# EAGLE design headlight (EAGLE 5.09)
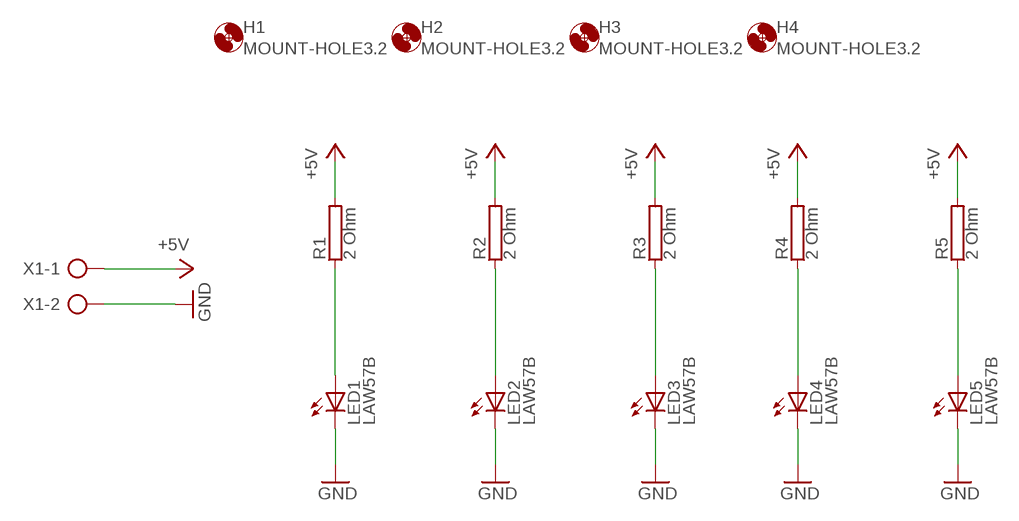
[diagram p0: schematic, sheet 1]

## Parts
H1  MOUNT-HOLE3.2  [3,2]
H2  MOUNT-HOLE3.2  [3,2]
H3  MOUNT-HOLE3.2  [3,2]
H4  MOUNT-HOLE3.2  [3,2]
LED1  LAW57B  [W57B]
LED2  LAW57B  [W57B]
LED3  LAW57B  [W57B]
LED4  LAW57B  [W57B]
LED5  LAW57B  [W57B]
R1  2 Ohm  RKH216-8  [KH216-8]
R2  2 Ohm  RKH216-8  [KH216-8]
R3  2 Ohm  RKH216-8  [KH216-8]
R4  2 Ohm  RKH216-8  [KH216-8]
R5  2 Ohm  RKH216-8  [KH216-8]
X1  AK300/2  [AK300/2]

## Nets
+5V: R1.2 R2.2 R3.2 R4.2 R5.2 X1.1
GND: LED1.C LED2.C LED3.C LED4.C LED5.C X1.2
N$1: LED1.A R1.1
N$2: LED2.A R2.1
N$3: LED3.A R3.1
N$4: LED4.A R4.1
N$5: LED5.A R5.1
Unconnected: LED1.C@1(C) LED1.C@2(C) LED1.C@3(C) LED1.C@4(C) LED1.C@5(C) LED2.C@1(C) LED2.C@2(C) LED2.C@3(C) LED2.C@4(C) LED2.C@5(C) LED3.C@1(C) LED3.C@2(C) LED3.C@3(C) LED3.C@4(C) LED3.C@5(C) LED4.C@1(C) LED4.C@2(C) LED4.C@3(C) LED4.C@4(C) LED4.C@5(C) LED5.C@1(C) LED5.C@2(C) LED5.C@3(C) LED5.C@4(C) LED5.C@5(C)

## Library data of the parts
H1-H4 = holes:MOUNT-HOLE: MOUNTING HOLE with drill center marker
LED1-LED5 = led:*W57B: Golden Dragon® 1 Watt LED Place heat sink pads of cathode with INVOKE Source: www.osram-os.com la_ly_w57b.pdf
R1-R5 = resistor-power:R: Power Resitor
X1 = con-ptr500:AK300/2: CONNECTOR

## Board
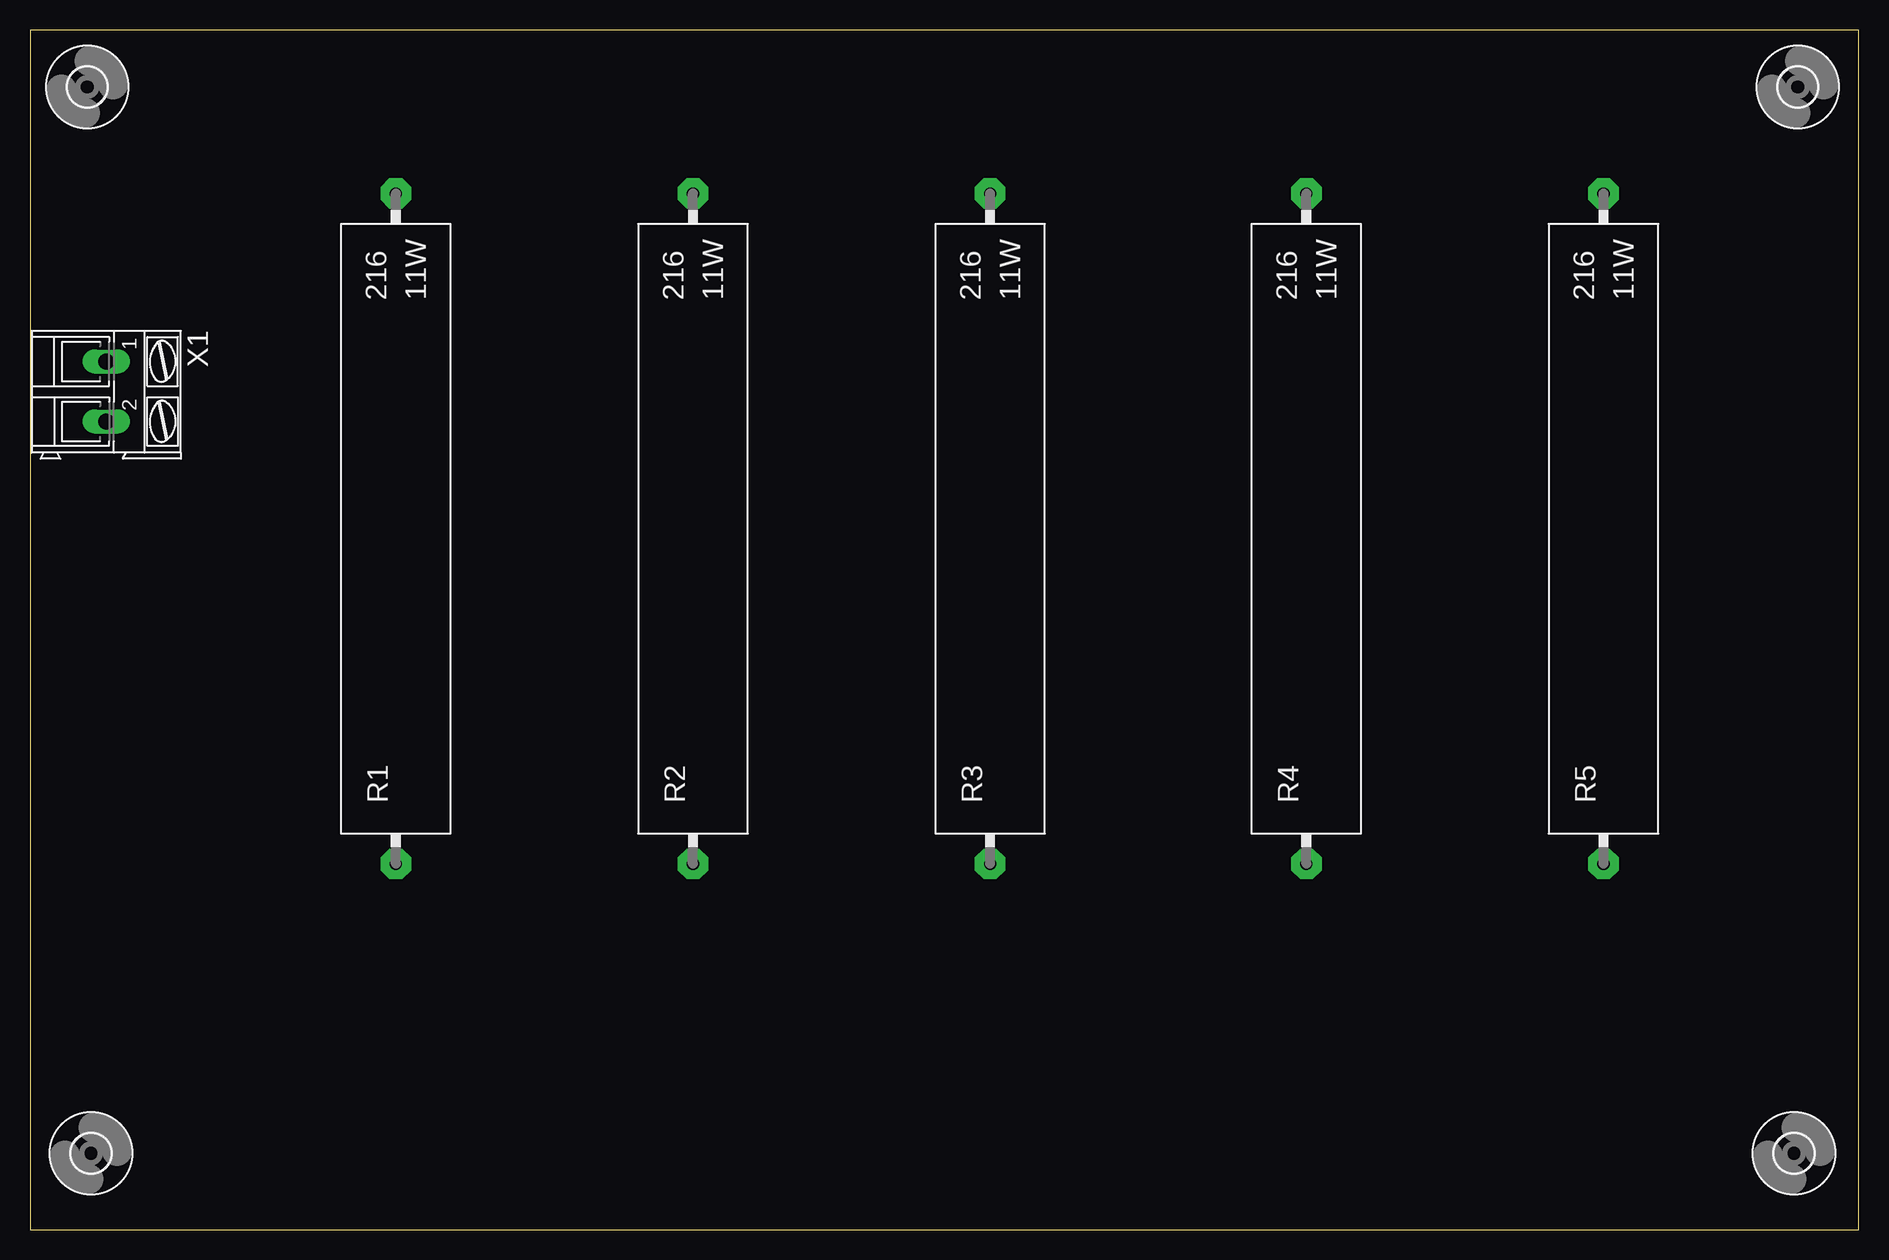
[diagram p1: board, top side]
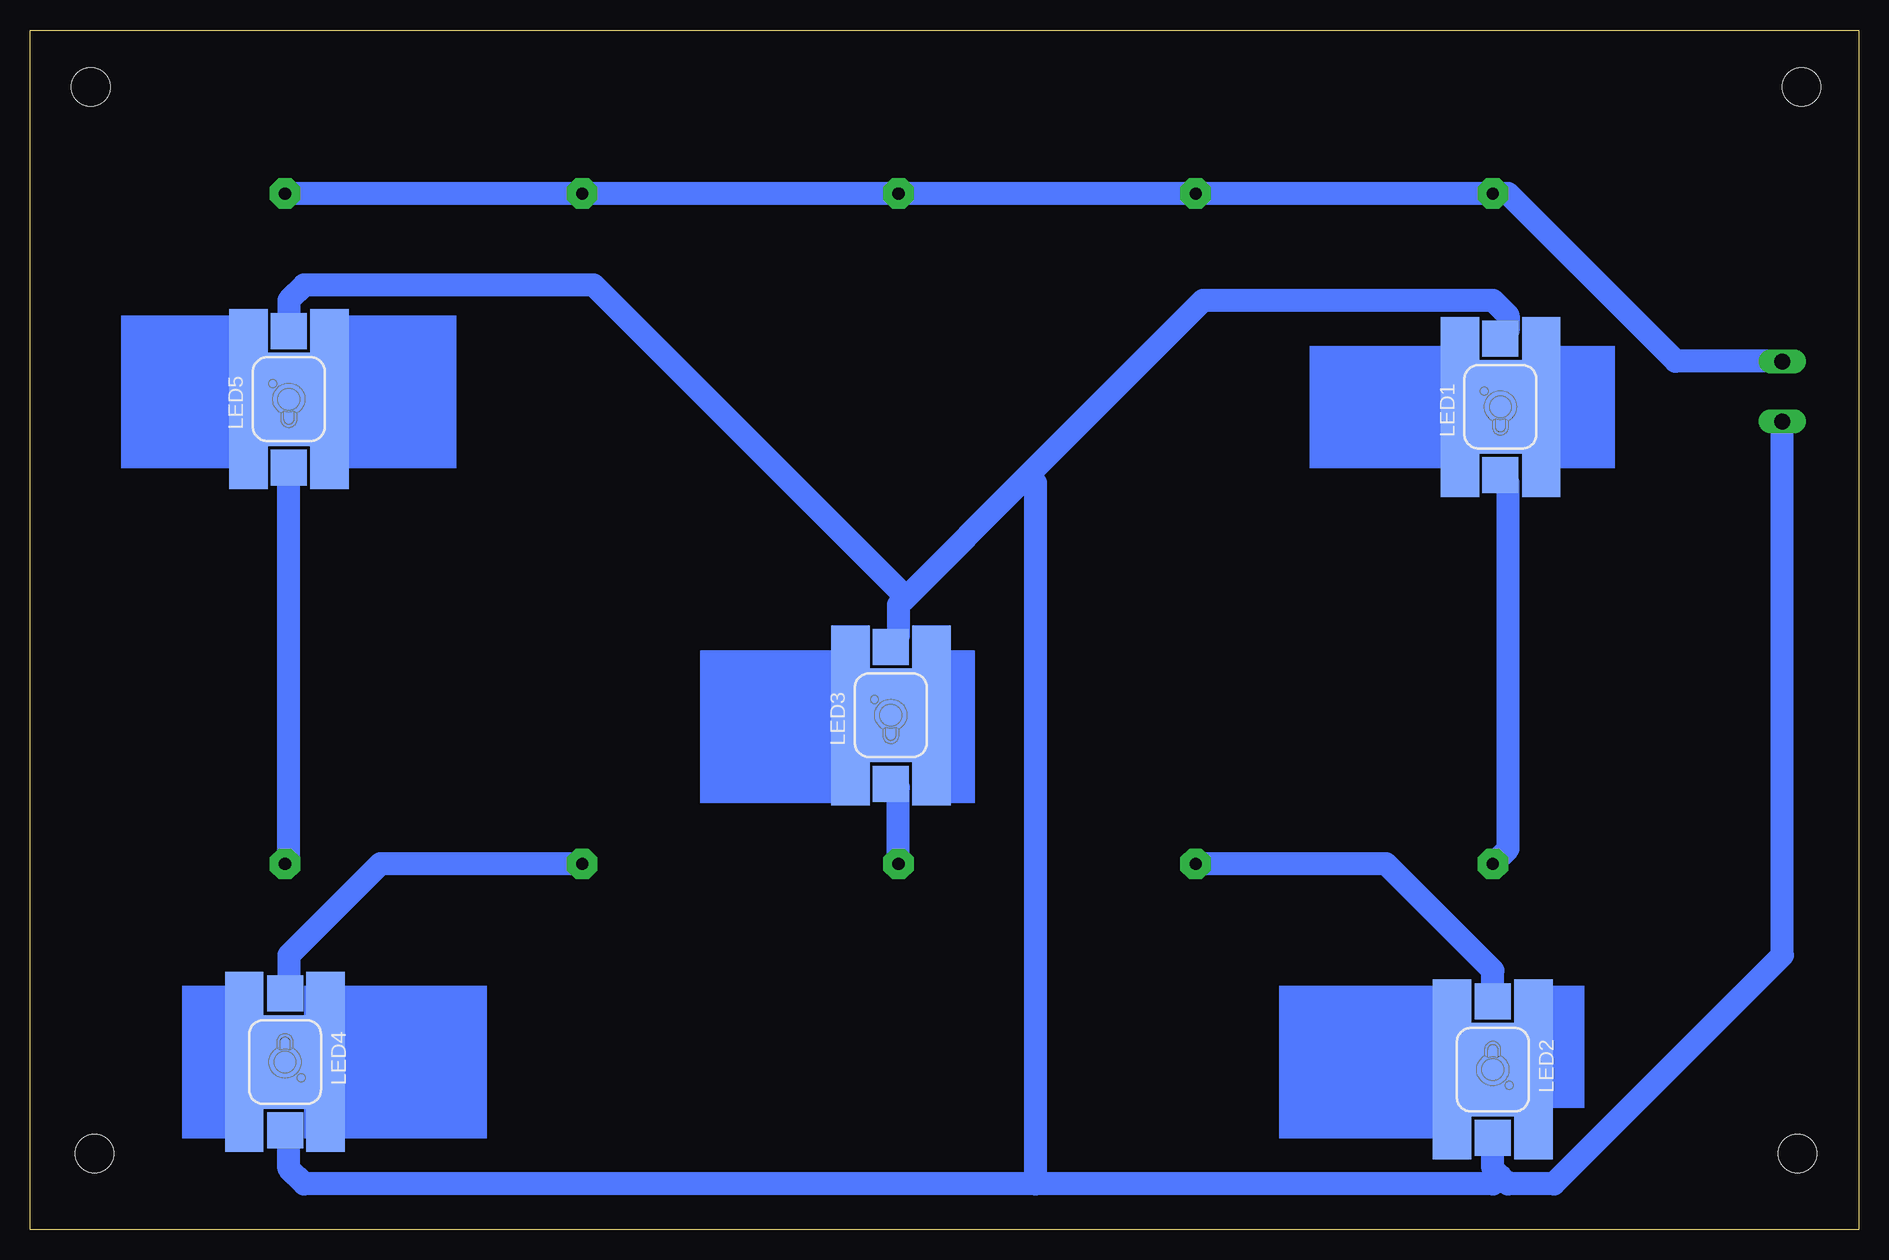
[diagram p2: board, bottom side, seen from below]

Size 152.38 x 100 mm. Coordinates in mm from the lower left corner, seen from the top.
Outline: 0,0 152.38,0 152.38,100 0,100 0,0
Copper layers (1*16): Top 0.035mm / dielectric 1.5mm / Bottom 0.035mm
Design rules "default *": minimum track width 75mil, minimum drill 24mil, track to track 8mil, track to pad 8mil, pad to pad 8mil, via to via 8mil, smd to smd 8mil, copper to edge 40mil, drill to drill 8mil, minimum pad ring 10mil, minimum via ring 8mil, stop-mask expansion 4mil, vias tented up to drill 0mil, thermal gap 10mil

### Footprints (pad centres in the part's own frame; a part is rotated, then mirrored left to right if it is on the bottom)
3,2 = hole 3.2: 0,0
W57B = smd 3 x 3: A -5.7,0; C 5.7,0 | smd 7.5 x 3.2: C@1 3.75,3.375; C@2 -3.75,3.375; C@3 -3.75,-3.4; C@4 3.75,-3.4 | smd 7.8 x 4: C@5 0,0
KH216-8 = drill 1.016 pad 2.54 octagon: 1 -27.94,0; 2 27.94,0
AK300/2 = drill 1.321 long: 1 -2.515,0; 2 2.489,0

### Placement (x,y rotation side)
H1  147.32,95.25 0 top
H2  5.08,6.35 0 top
H3  147,6.35 0 top
H4  4.76,95.25 0 top
LED1  29.84,68.58 90 bottom
LED2  30.48,13.34 270 bottom
LED3  80.64,42.86 90 bottom
LED4  131.13,13.97 270 bottom
LED5  130.81,69.22 90 bottom
R1  30.48,58.42 90 top
R2  55.24,58.42 90 top
R3  80.01,58.42 90 top
R4  106.36,58.42 90 top
R5  131.13,58.42 90 top
X1  6.35,69.85 270 top

### Tracks (layer width: path | path; a pad name or v marks a point on that pad's centre or on a via)
+5V
  Bottom 1.905: R5.2 R4.2 R3.2 R2.2 R1.2 29.21,86.36 15.24,72.39 6.35,72.39 X1.1
GND
  Bottom 1.905: 69.22,62.87 54.61,77.47 30.48,77.47 29.21,76.2 29.21,74.93 LED1.C | 69.22,62.87 79.38,52.7 | 79.38,52.7 80.01,52.07 80.01,49.53 LED3.C | LED5.C 130.81,77.47 129.54,78.74 105.41,78.74 79.38,52.7 | 29.84,4.45 29.21,3.81 25.4,3.81 6.35,22.86 X1.2 | 29.84,4.45 30.48,5.08 LED2.C | 68.58,3.81 30.48,3.81 29.84,4.45 | 68.58,3.81 129.54,3.81 130.81,5.08 130.81,7.62 LED4.C | 68.58,3.81 68.58,62.23 69.22,62.87
N$1
  Bottom 1.905: R1.1 29.21,31.75 29.21,62.23 LED1.A
N$2
  Bottom 1.905: LED2.A 30.48,21.59 39.37,30.48 R2.1
N$3
  Bottom 1.905: R3.1 80.01,36.83 LED3.A
N$4
  Bottom 1.905: LED4.A 130.81,20.32 130.81,22.86 123.19,30.48 R4.1
N$5
  Bottom 1.905: LED5.A 130.81,30.48 R5.1
(copper drawn outside any net)
  shapes: Bottom area x10